# EAGLE design sim (EAGLE 4.13)
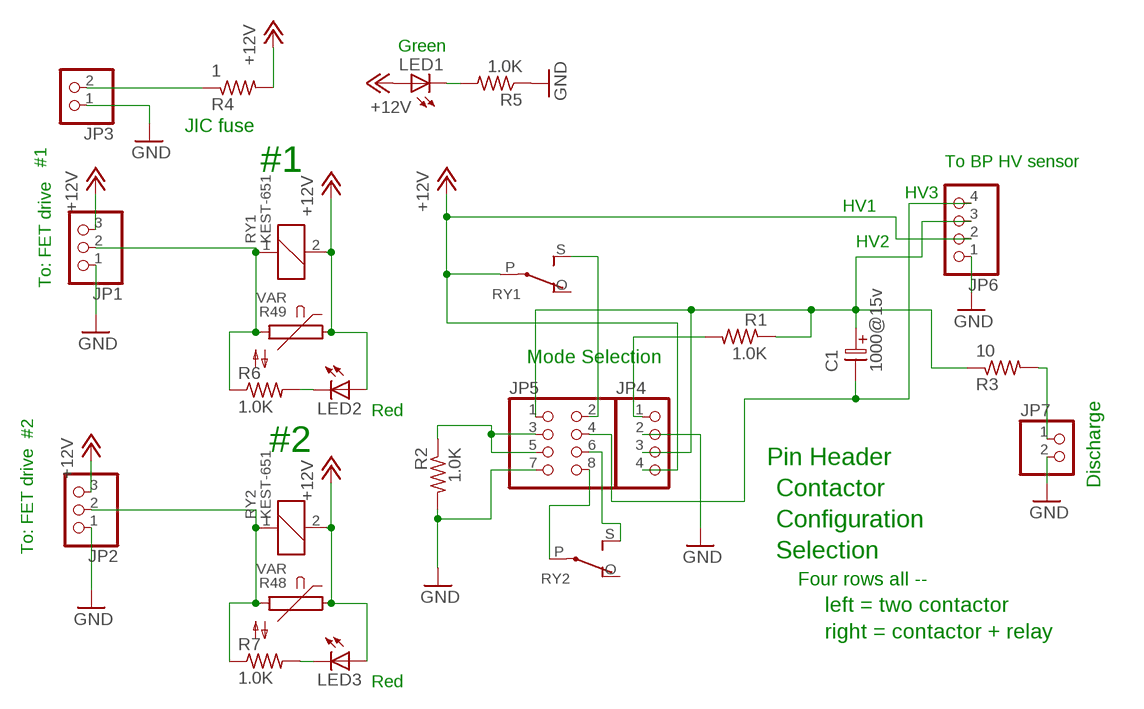
[diagram p0: schematic, sheet 1]

## Parts
C1  1000@15v  ELC-2,5L  [ES-2,5L]
JP1  PINHD-1X3  [1X03]
JP2  PINHD-1X3  [1X03]
JP3  PINHD-1X2  [1X02]
JP4  PINHD-1X4  [1X04]
JP5  PINHD-2X4  [2X04]
JP6  PINHD-1X4  [1X04]
JP7  PINHD-1X2  [1X02]
LED1  LEDCHIPLED_0805  [CHIPLED_0805]
LED2  LEDCHIPLED_0805  [CHIPLED_0805]
LED3  LEDCHIPLED_0805  [CHIPLED_0805]
R1  1.0K  R-US_R0603  [R0603]
R2  1.0K  R-US_R0603  [R0603]
R3  10  R-US_R0603  [R0603]
R4  1  R-US_R0603  [R0603]
R5  1.0K  R-US_R0603  [R0603]
R6  1.0K  R-US_R0603  [R0603]
R7  1.0K  R-US_R0603  [R0603]
R48  VAR  S05K40  [S05K40]
R49  VAR  S05K40  [S05K40]
RY1  KEST-651  [KEST-651]
RY2  KEST-651  [KEST-651]

## Nets
+12V: JP1.3 JP2.3 JP4.4 JP6.2 LED1.A LED2.A LED3.A R4.2 R48.1 R49.1 RY1.2 RY1.P RY2.2
GND: JP1.1 JP2.1 JP3.1 JP4.2 JP5.7 JP6.1 JP7.2 R2.2 R5.1
INPUT_12V: JP3.2 R4.1
LED1: LED1.C R5.2
LED2: LED2.C R6.2
N$1: JP5.8 RY2.P
N$2: JP1.2 R6.1 R49.2 RY1.1
N$3: JP2.2 R7.1 R48.2 RY2.1
N$4: JP5.6 RY2.S
N$5: JP4.1 R1.2
N$6: C1.2 JP5.4 JP6.4
N$7: JP5.2 RY1.S
N$8: C1.1 JP4.3 JP5.1 JP6.3 R1.1 R3.1
N$9: JP7.1 R3.2
N$10: JP5.3 JP5.5 R2.1
N$12: LED3.C R7.2
Unconnected: RY1.O RY2.O

## Notes on the sheet
- Green
- JIC fuse
- #1 | #1 | To BP HV sensor
- HV3
- HV1
- HV2
- To: FET drive
- Mode Selection
- Red
- #2
- #2
- Pin Header
- Discharge
- Contactor
- Configuration
- To: FET drive | Selection
- Four rows all --
- left = two contactor
- right = contactor + relay
- Red

## Library data of the parts
C1 = DEH:ELC-2,5L
JP1 JP2 = pinhead:PINHD-1X3: PIN HEADER
JP3 JP7 = pinhead:PINHD-1X2: PIN HEADER
JP4 JP6 = pinhead:PINHD-1X4: PIN HEADER
JP5 = pinhead:PINHD-2X4: PIN HEADER
LED1-LED3 = led:LED: LED OSRAM: - CHIPLED LG R971, LG N971, LY N971, LG Q971, LY Q971, LO R971, LY R971 LH N974, LH R974 LS Q976, LO Q976, LY Q976 LO Q996 - Hyper CHIPLED LW Q18S LB Q993, LB Q99A, LB R99A - SideLED LS A670, LO A670, LY A670, LG A670, LP A670 LB A673, LV A673, LT A673, LW A673 LH A674 LY A675 LS A676, LA A676, LO A676, LY A676, LW A676 LS A679, LY A679, LG A679 - Hyper Micro SIDELED® LS Y876, LA Y876, LO Y876, LY Y876 LT Y87S - SmartLED LW L88C, LW L88S LB L89C, LB L89S, LG L890 LS L89K, LO L89K, LY L89K LS L896, LA L896, LO L896, LY L896 - TOPLED LS T670, LO T670, LY T670, LG T670, LP T670 LSG T670, LSP T670, LSY T670, LOP T670, LYG T670 LG T671, LOG T671, LSG T671 LB T673, LV T673, LT T673, LW T673 LH T674 LS T676, LA T676, LO T676, LY T676, LB T676, LH T676, LSB T676, LW T676 LB T67C, LV T67C, LT T67C, LS T67K, LO T67K, LY T67K, LW E67C LS E67B, LA E67B, LO E67B, LY E67B, LB E67C, LV E67C, LT E67C LW T67C LS T679, LY T679, LG T679 LS T770, LO T770, LY T770, LG T770, LP T770 LB T773, LV T773, LT T773, LW T773 LH T774 LS E675, LA E675, LY E675, LS T675 LS T776, LA T776, LO T776, LY T776, LB T776 LHGB T686 LT T68C, LB T68C - Hyper Mini TOPLED® LB M676 - Mini TOPLED Santana® LG M470 LS M47K, LO M47K, LY M47K Source: http://www.osram.convergy.de/
R1-R7 = rcl:R-US_: RESISTOR, American symbol
R48 R49 = VARIST:S05K40
RY1 RY2 = RELAIS:KEST-651

## Board
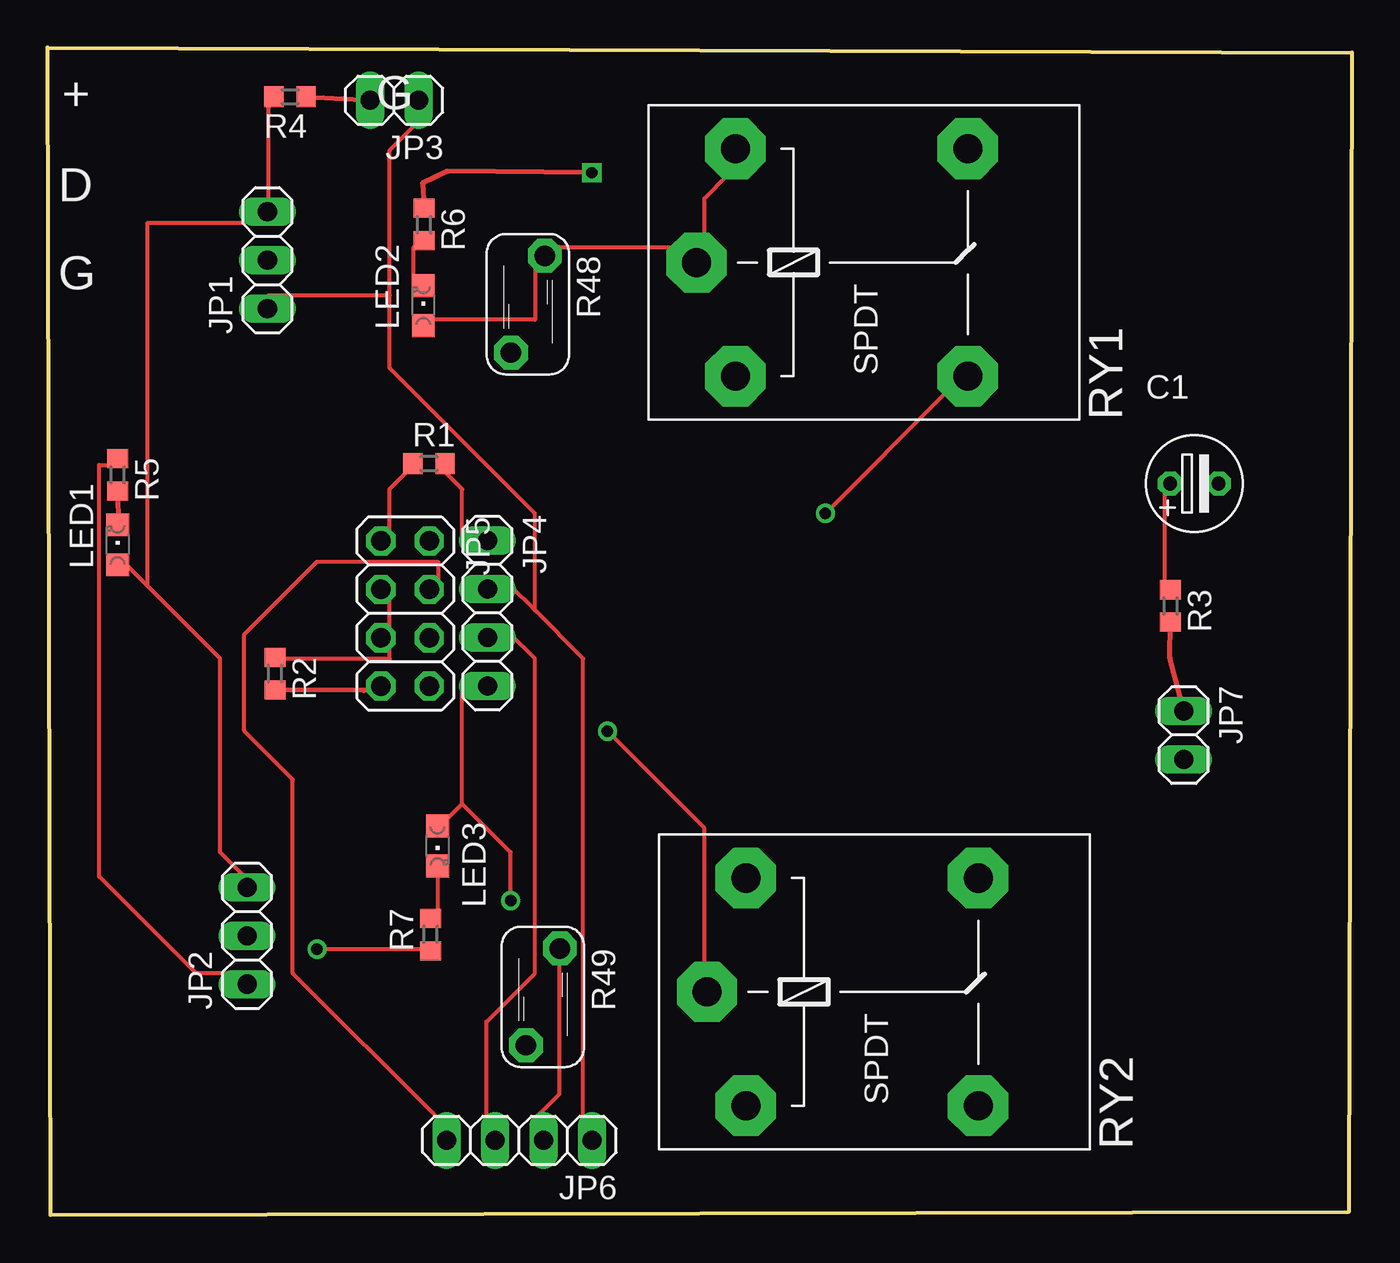
[diagram p1: board, top side]
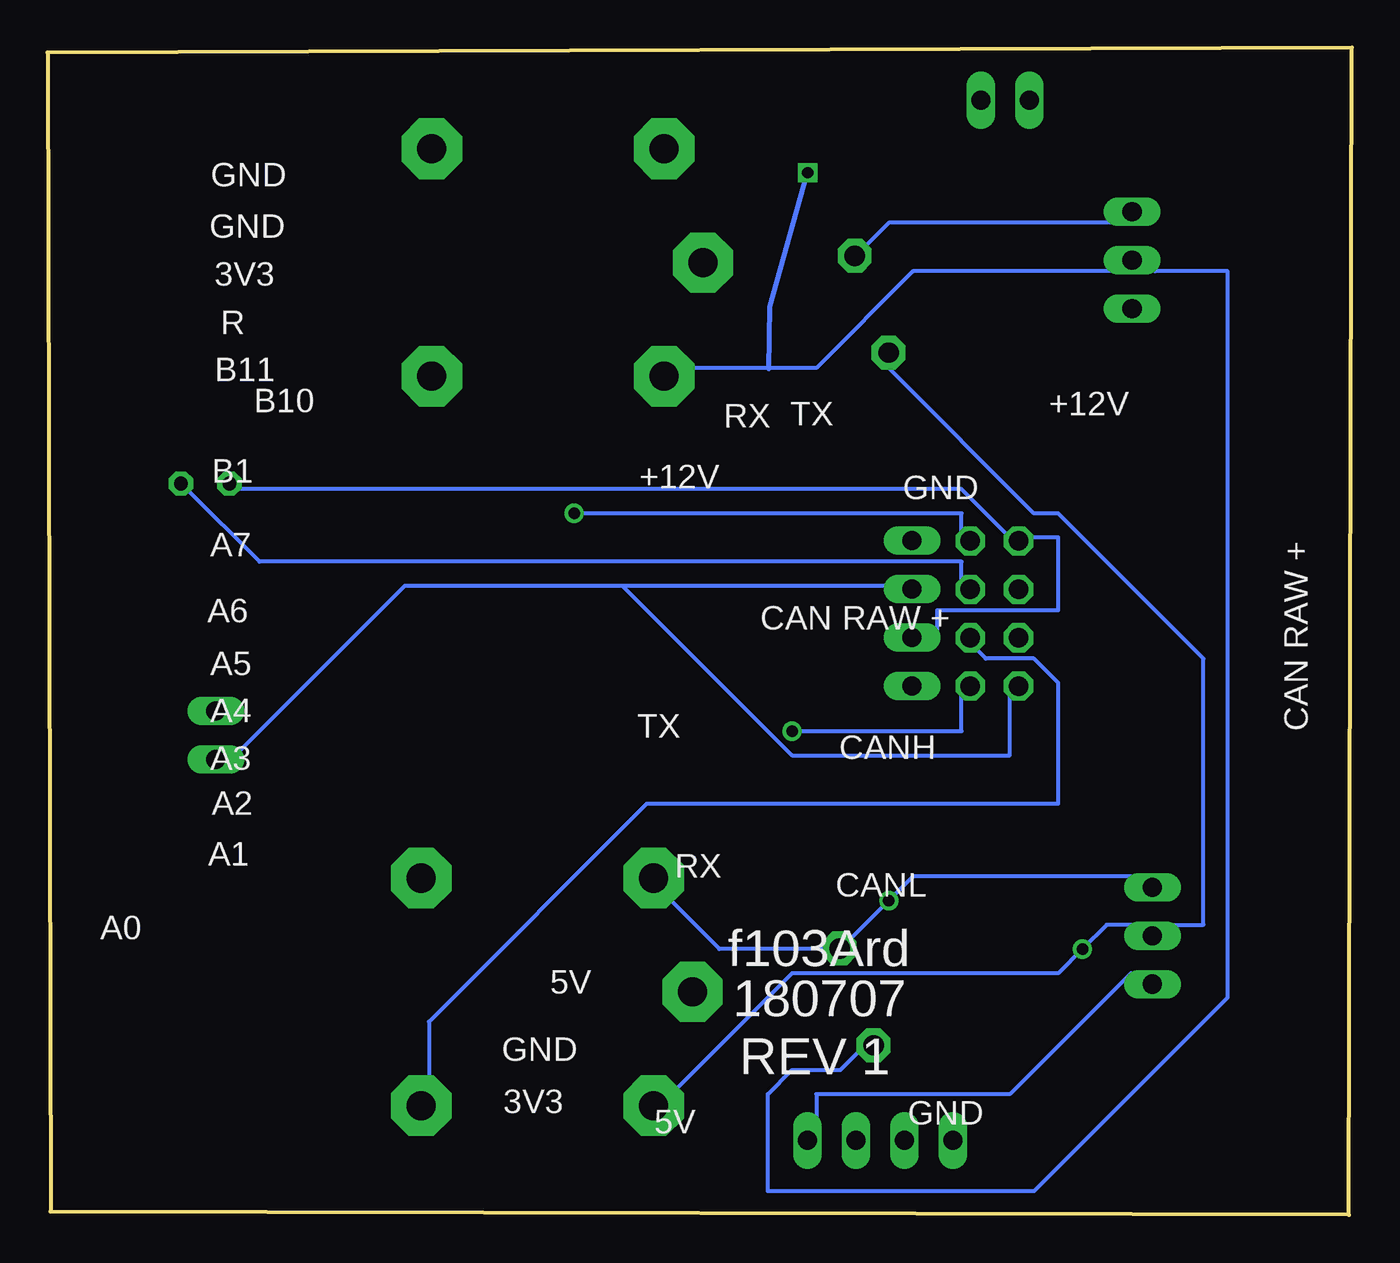
[diagram p2: board, bottom side, seen from below]

Size 68.42 x 61.24 mm. Coordinates in mm from the lower left corner, seen from the top.
Outline: 0.16,0 0,61.24 68.42,60.98 68.27,0.17 0.16,0
Copper layers (1*16): Top 0.035mm / dielectric 0.2032mm / Bottom 0.035mm
Design rules "default": minimum track width 8mil, minimum drill 0.6mm, track to track 8mil, track to pad 8mil, pad to pad 10mil, via to via 8mil, smd to smd 0mil, copper to edge 8mil, drill to drill 8mil, minimum pad ring 8mil, minimum via ring 8mil, stop-mask expansion 4mil, vias tented up to drill 0mil, thermal gap 10mil

### Footprints (pad centres in the part's own frame; a part is rotated, then mirrored left to right if it is on the bottom)
ES-2,5L = drill 0.711 pad 1.27 octagon: 1 0,0; 2 2.54,0
1X03 = drill 1 long: 1 -2.54,0; 2 0,0; 3 2.54,0
1X02 = drill 1 long: 1 -1.27,0; 2 1.27,0
1X04 = drill 1 long: 1 -3.81,0; 2 -1.27,0; 3 1.27,0; 4 3.81,0
2X04 = drill 1.016 octagon: 1 -3.81,-1.27; 2 -3.81,1.27; 3 -1.27,-1.27; 4 -1.27,1.27; 5 1.27,-1.27; 6 1.27,1.27; 7 3.81,-1.27; 8 3.81,1.27
CHIPLED_0805 = smd 1.2 x 1.2: A 0,-1.05; C 0,1.05
R0603 = smd 1 x 1.1: 1 -0.85,0; 2 0.85,0
S05K40 = drill 1.067 pad 1.778 octagon: 1 -0.889,-2.54; 2 0.889,2.54
KEST-651 = drill 1.524 pad 3.175 octagon: 1 1.932,-6.069; 2 1.932,5.869; O 14.124,5.869; S 14.124,-6.069 | drill 1.524 pad 3.15 octagon: P -0.1,-0.1

### Placement (x,y rotation side)
C1  58.89,38.37 0 top
JP1  11.53,50.09 90 top
JP2  10.46,14.65 90 top
JP3  18.18,58.48 180 top
JP4  23.07,31.57 270 top
JP5  18.75,31.55 270 top
JP6  24.74,3.91 180 top
JP7  59.6,25.17 270 top
LED1  3.67,35.16 0 top
LED2  19.71,47.71 0 top
LED3  20.45,19.36 180 top
R1  20.01,39.42 0 top
R2  11.93,28.4 270 top
R3  58.9,31.95 270 top
R4  12.72,58.66 180 top
R5  3.67,38.83 270 top
R6  19.74,51.96 270 top
R7  20.08,14.71 90 top
R48  25.19,47.78 180 top
R49  25.98,11.44 180 top
RY1  34.15,50.07 0 top
RY2  34.7,11.8 0 top

### Tracks (layer width: path | path; a pad name or v marks a point on that pad's centre or on a via)
+12V  (via drill 0.6)
  Top 0.203: 21.75,21.57 20.48,20.3 LED3.A | 21.75,21.57 21.75,27.92 JP4.4 | JP6.2 25.56,5.06 26.83,6.33 26.83,13.95 R49.1 | 21.75,21.57 24.29,19.03 v24.29,16.49 | LED2.A 19.21,46.97 25.56,46.97 25.56,50.78 R48.1 26.83,50.78 33.18,50.78 RY1.P 34.45,50.78 34.45,53.32 35.72,54.59 RY1.2 | R4.2 11.59,58.4 11.59,53.32 JP1.3 10.32,52.05 5.24,52.05 5.24,33 | 5.24,33 9.05,29.19 9.05,19.03 10.32,17.76 JP2.3 | 5.24,33 3.97,34.27 LED1.A
  Bottom 0.203: 26.83,13.95 v24.29,16.49 23.02,17.76 11.59,17.76 JP2.3 | 26.83,13.95 33.18,13.95 35.72,16.49 RY2.2 | 26.83,13.95 R49.1 | R48.1 25.56,50.78 24.29,52.05 11.59,52.05 JP1.3
GND
  Top 0.203: 17.94,48.24 11.59,48.24 JP1.1 | 17.94,48.24 17.94,55.86 19.21,57.13 JP3.1 | R5.1 3.97,39.35 2.7,39.35 2.7,17.76 7.78,12.68 10.32,12.68 JP2.1 | 25.56,31.73 28.1,29.19 28.1,5.06 JP6.1 | 25.56,31.73 24.29,33 JP4.2 | 17.94,48.24 17.94,44.43 25.56,36.81 25.56,31.73
  Top 0.254: R2.2 16.58,27.51 17.52,27.73 JP5.7
  Bottom 0.203: JP6.1 28.1,5.06 28.1,6.33 17.94,6.33 11.59,12.68 JP2.1 | 38.26,33 24.29,33 JP4.2 | 38.26,33 49.69,33 58.58,24.11 JP7.2 | 38.26,33 29.37,24.11 17.94,24.11 17.94,27.92 JP5.7
INPUT_12V
  Top 0.254: JP3.2 17,58.47 R4.1
LED1
  Top 0.254: LED1.C 3.7,36.14 R5.2
LED2
  Top 0.203: R6.2 19.21,50.78 19.21,48.24 LED2.C
N$1  (via drill 0.6)
  Top 0.203: v29.37,25.38 34.45,20.3 34.45,12.68 RY2.P
  Bottom 0.203: v29.37,25.38 20.48,25.38 20.48,27.92 JP5.8
N$2  (via drill 0.6)
  Top 0.254: R6.1 19.67,54.12 20.99,54.75 v28.55,54.68
  Bottom 0.203: RY1.1 35.72,44.43 30.58,44.43 28.1,44.43 23.02,49.51 11.59,49.51 JP1.2 10.32,49.51 6.51,49.51 6.51,11.41 16.67,1.25 30.64,1.25 30.64,6.33 29.37,7.6 26.83,7.6 25.56,8.87 R49.2
  Bottom 0.254: v28.55,54.68 30.53,47.66 30.58,44.39 30.58,44.43
N$3  (via drill 0.6)
  Top 0.203: v14.13,13.95 20.48,13.95 R7.1
  Bottom 0.203: R48.2 24.29,44.43 16.67,36.81 15.4,36.81 7.78,29.19 7.78,15.22 10.32,15.22 JP2.2 11.59,15.22 12.86,15.22 v14.13,13.95 15.4,12.68 29.37,12.68 35.72,6.33 RY2.1
N$4
  Bottom 0.203: JP5.6 20.48,30.46 19.21,29.19 16.67,29.19 15.4,27.92 15.4,21.57 36.99,21.57 48.42,10.14 48.42,6.33 RY2.S
N$5
  Top 0.203: R1.2 20.48,39.35 21.75,38.08 21.75,35.54 JP4.1
N$6
  Top 0.203: JP6.4 20.48,5.06 12.86,12.68 12.86,22.84 10.32,25.38 10.32,30.46 14.13,34.27 20.48,34.27 20.48,33 JP5.4
  Bottom 0.203: C1.2 61.12,38.08 57.31,34.27 20.48,34.27 20.48,33 JP5.4
N$7  (via drill 0.6)
  Top 0.203: v40.8,36.81 47.15,43.16 RY1.S
  Bottom 0.203: v40.8,36.81 20.48,36.81 20.48,35.54 JP5.2
N$8
  Top 0.203: JP4.3 24.29,30.46 25.56,29.19 25.56,12.68 23.02,10.14 23.02,5.06 JP6.3 | R1.1 19.21,39.35 17.94,38.08 17.94,35.54 JP5.1 | R3.1 58.58,33 58.58,38.08 C1.1
  Bottom 0.203: 17.94,35.54 20.48,38.08 58.58,38.08 C1.1 | 17.94,35.54 15.4,35.54 15.4,31.73 21.75,31.73 21.75,30.46 JP4.3 | 17.94,35.54 JP5.1
N$9
  Top 0.254: R3.2 58.88,29.22 59.62,26.35 JP7.1
N$10
  Top 0.203: 17.94,30.46 17.94,29.19 11.59,29.19 R2.1 | 17.94,30.46 17.94,33 JP5.3 | 17.94,30.46 JP5.5
N$12
  Top 0.203: R7.2 20.48,15.22 20.48,17.76 LED3.C

### Text on the board
tNames: + | G | D | G
bNames: GND | GND | 3V3 | DIV2 | R | B9BUF | B7BUF | B11 | +12V | B10 | DIV6 | TX | RX | GND | +12V | B1 | CAN RAW + | A7 | 12V | 5V | CAN RAW + | A6 | A5 | A4 | TX | CANH | A3 | A2 | RX | A1 | CANL | A0 | f103Ard | 5V | B8BUF | B5BUF | DIV1 | 180707 | DIV5 | GND | REV 1 | GND | 3V3 | 5V | 5V | 5V
bStop: f103Ard | 07/01/2018